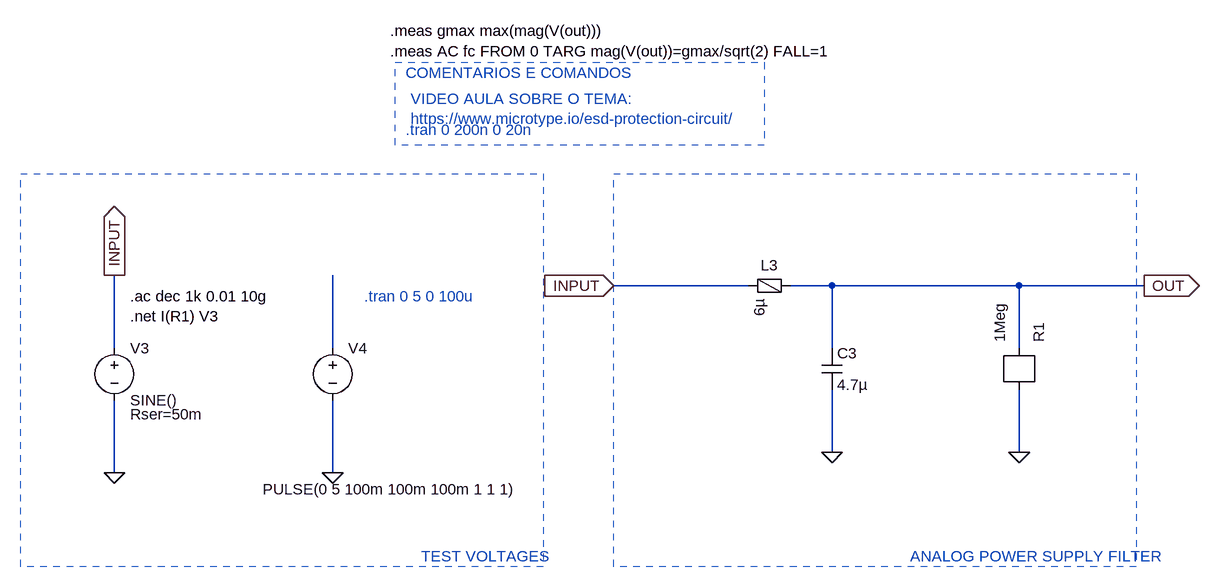
[diagram p0: schematic analog_ps_filter.asc]
analog_ps_filter.asc, the LTspice schematic file:
Version 4
SHEET 1 1692 1364
WIRE 832 -384 624 -384
WIRE 960 -384 896 -384
WIRE 1248 -384 960 -384
WIRE 1440 -384 1248 -384
WIRE -144 -288 -144 -400
WIRE 192 -288 192 -400
WIRE 960 -288 960 -384
WIRE 1248 -288 1248 -384
WIRE 960 -128 960 -224
WIRE 1248 -128 1248 -224
WIRE -144 -96 -144 -208
WIRE 192 -96 192 -208
FLAG 624 -384 INPUT
IOPIN 624 -384 In
FLAG 1440 -384 OUT
IOPIN 1440 -384 Out
FLAG 960 -128 0
FLAG -144 -96 0
FLAG 192 -96 0
FLAG -144 -400 INPUT
IOPIN -144 -400 Out
FLAG 1248 -128 0
SYMBOL FerriteBead 864 -384 R90
WINDOW 0 -16 0 VBottom 2
SYMATTR InstName L3
SYMATTR Value 6µ
SYMATTR SpiceLine Ipk=1 Rser=286m Rpar=1.65K Cpar=1p mfg="Würth Elektronik" pn="782853152 WE-CBA 0805"
SYMBOL cap 944 -288 R0
SYMATTR InstName C3
SYMATTR Value 4.7µ
SYMATTR SpiceLine Rser=.1
SYMBOL voltage -144 -304 R0
WINDOW 39 24 118 Left 2
SYMATTR SpiceLine Rser=50m
SYMATTR InstName V3
SYMATTR Value SINE()
SYMATTR Value2 AC 1
SYMBOL voltage 192 -304 R0
WINDOW 3 -108 233 Left 2
SYMATTR Value PULSE(0 5 100m 100m 100m 1 1 1)
SYMATTR InstName V4
SYMBOL r 1248 -224 M270
SYMATTR InstName R1
SYMATTR Value 1Meg
TEXT 304 -624 Left 2 ;.tran 0 200n 0 20n
TEXT 1080 32 Left 2 ;ANALOG POWER SUPPLY FILTER
TEXT 312 -672 Left 2 ;VIDEO AULA SOBRE O TEMA:\nhttps://www.microtype.io/esd-protection-circuit/
TEXT 304 -712 Left 2 ;COMENTARIOS E COMANDOS
TEXT -120 -368 Left 2 !.ac dec 1k 0.01 10g\n.net I(R1) V3
TEXT 240 -368 Left 2 ;.tran 0 5 0 100u
TEXT 328 32 Left 2 ;TEST VOLTAGES
TEXT 280 -776 Left 2 !.meas gmax max(mag(V(out)))\n.meas AC fc FROM 0 TARG mag(V(out))=gmax/sqrt(2) FALL=1
RECTANGLE Normal 624 -556 1428 48 2
RECTANGLE Normal 288 -728 856 -600 2
RECTANGLE Normal -288 -556 516 48 2

The netlist it stands for:
* analog_ps_filter.asc
L3 OUT INPUT 6µ Ipk=1 Rser=286m Rpar=1.65K Cpar=1p mfg="Würth Elektronik" pn="782853152 WE-CBA 0805"
C3 OUT 0 4.7µ Rser=.1
V3 INPUT 0 SINE() AC 1 Rser=50m
V4 N001 0 PULSE(0 5 100m 100m 100m 1 1 1)
R1 OUT 0 1Meg
* .tran 0 200n 0 20n
* ANALOG POWER SUPPLY FILTER
* VIDEO AULA SOBRE O TEMA:
* https://www.microtype.io/esd-protection-circuit/
* COMENTARIOS E COMANDOS
.ac dec 1k 0.01 10g
.net I(R1) V3
* .tran 0 5 0 100u
* TEST VOLTAGES
.meas gmax max(mag(V(out)))
.meas AC fc FROM 0 TARG mag(V(out))=gmax/sqrt(2) FALL=1
.backanno
.end